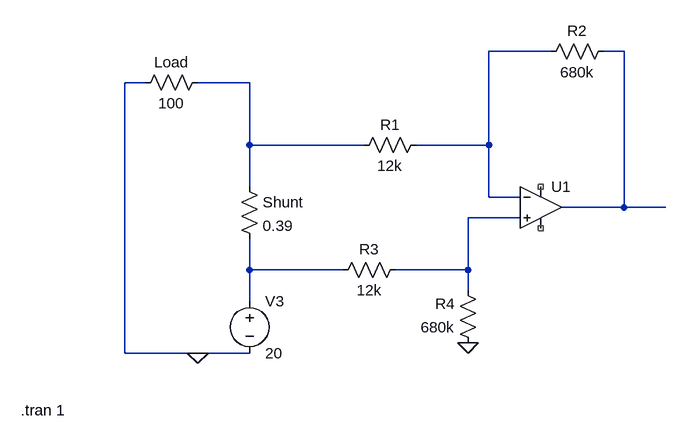
[diagram p0: schematic Current.asc]
Current.asc, the LTspice schematic file:
Version 4
SHEET 1 880 680
WIRE -320 0 -416 0
WIRE -208 0 -240 0
WIRE -944 48 -976 48
WIRE -784 48 -864 48
WIRE -784 144 -784 48
WIRE -608 144 -784 144
WIRE -416 144 -416 0
WIRE -416 144 -528 144
WIRE -784 208 -784 144
WIRE -416 224 -416 144
WIRE -368 224 -416 224
WIRE -208 240 -208 0
WIRE -208 240 -304 240
WIRE -144 240 -208 240
WIRE -368 256 -448 256
WIRE -784 336 -784 288
WIRE -640 336 -784 336
WIRE -448 336 -448 256
WIRE -448 336 -560 336
WIRE -448 368 -448 336
WIRE -784 384 -784 336
WIRE -976 464 -976 48
WIRE -864 464 -976 464
WIRE -784 464 -864 464
FLAG -448 448 0
FLAG -864 464 0
DATAFLAG -144 240 ""
SYMBOL OpAmps\\UniversalOpAmp -336 240 R0
SYMATTR InstName U1
SYMBOL res -512 128 R90
WINDOW 0 0 56 VBottom 2
WINDOW 3 32 56 VTop 2
SYMATTR InstName R1
SYMATTR Value 12k
SYMBOL res -224 -16 R90
WINDOW 0 0 56 VBottom 2
WINDOW 3 32 56 VTop 2
SYMATTR InstName R2
SYMATTR Value 680k
SYMBOL res -432 464 R180
WINDOW 0 36 76 Left 2
WINDOW 3 36 40 Left 2
SYMATTR InstName R4
SYMATTR Value 680k
SYMBOL voltage -784 368 R0
WINDOW 123 0 0 Left 0
WINDOW 39 0 0 Left 0
SYMATTR InstName V3
SYMATTR Value 20
SYMBOL res -800 192 R0
SYMATTR InstName Shunt
SYMATTR Value 0.39
SYMBOL res -848 32 R90
WINDOW 0 0 56 VBottom 2
WINDOW 3 32 56 VTop 2
SYMATTR InstName Load
SYMATTR Value 100
SYMBOL res -544 320 R90
WINDOW 0 0 56 VBottom 2
WINDOW 3 32 56 VTop 2
SYMATTR InstName R3
SYMATTR Value 12k
TEXT -1136 552 Left 2 !.tran 1

The netlist it stands for:
* Current.asc
XU1 N004 N001 NC_01 NC_02 N002 level1 Avol=1Meg GBW=10Meg Vos=0 En=0 Enk=0 In=0 Ink=0 Rin=500Meg  ; pins In+ In- V+ V- OUT
R1 N001 N003 12k
R2 N002 N001 680k
R4 0 N004 680k
V3 N005 0 20
R§Shunt N003 N005 0.39
R§Load N003 0 100
R3 N004 N005 12k
.tran 1
.lib UniversalOpAmp1.lib
.backanno
.end